# Altium project HLW8012_SCH_PCB.PrjPcb
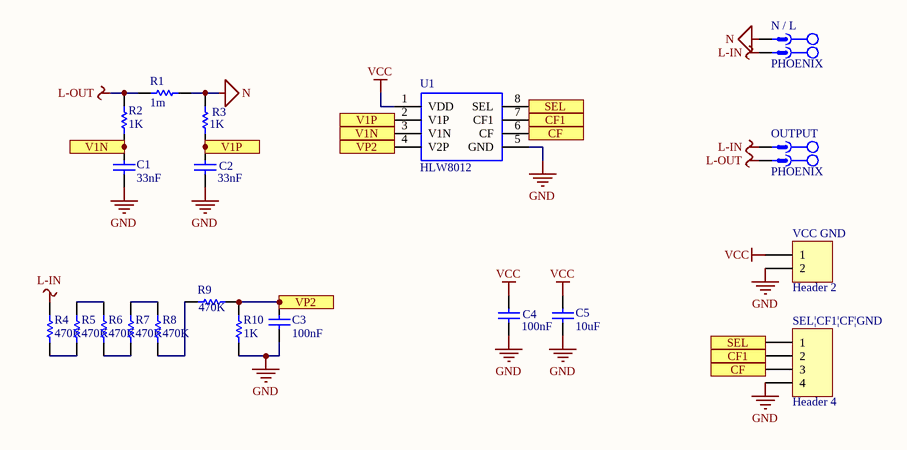
[diagram p0: Sheet.SchDoc]
1 sheet, 20 parts. Net scope: flat (ports and power ports of the same name join across sheets).
Board file: PCB.PcbDoc

## Sheet Sheet.SchDoc
size 203 x 127 mm; SheetNumber: 1; SheetTotal: 1

### Parts
C1  33nF  [CAP0603]
C2  33nF  [CAP0603]
C3  100nF  [CAP0603]
C4  100nF  [CAP805]
C5  10uF  [CAP805]
N_/_L  PHOENIX  [MSTB 2,5/2-G-5,08]
OUTPUT  PHOENIX  [MSTB 2,5/2-G-5,08]
R1  1m  [RES2512]
R2  1K  [RES0603_(1608X06L)]
R3  1K  [RES0603_(1608X06L)]
R4  470K  [RES0603_(1608X06L)]
R5  470K  [RES0603_(1608X06L)]
R6  470K  [RES0603_(1608X06L)]
R7  470K  [RES0603_(1608X06L)]
R8  470K  [RES0603_(1608X06L)]
R9  470K  [RES0603_(1608X06L)]
R10  1K  [RES0603_(1608X06L)]
SEL|CF1|CF|GND  Header 4  [HDR1X4]
U1  HLW8012  [SOIC127P600X170-8N]
VCC_GND  Header 2  [HDR1X2]

### Ports
CF1 (see Sheet[4B]), CF1 (see Sheet[5C]), CF (see Sheet[4B]), CF (see Sheet[5C]), SEL (see Sheet[4B]), SEL (see Sheet[5C]), V1N (see Sheet[1B]), V1N (see Sheet[3B]), V1P (see Sheet[2B]), V1P (see Sheet[3B]), VP2 (see Sheet[3B]), VP2 (see Sheet[3C])

### Nets
GND: C1.1 C2.1 C3.1 C4.1 C5.1 R10.1 SEL|CF1|CF|GND.4 U1.5(GND) VCC_GND.2
L-IN: N_/_L.2 OUTPUT.1 R4.1
L-OUT: OUTPUT.2 R1.2 R2.2
N: N_/_L.1 R1.1 R3.2
VCC: C4.2 C5.2 U1.1(VDD) VCC_GND.1
NetC1_2: C1.2 R2.1 U1.3(V1N) ; port V1N
NetC2_2: C2.2 R3.1 U1.2(V1P) ; port V1P
NetC3_2: C3.2 R9.2 R10.2 U1.4(V2P) ; port VP2
NetR4_2: R4.2 R5.1
NetR5_2: R5.2 R6.1
NetR6_2: R6.2 R7.1
NetR7_2: R7.2 R8.1
NetR8_2: R8.2 R9.1
NetSEL|CF1|CF|GND_1: SEL|CF1|CF|GND.1 U1.8(SEL) ; port SEL
NetSEL|CF1|CF|GND_2: SEL|CF1|CF|GND.2 U1.7(CF1) ; port CF1
NetSEL|CF1|CF|GND_3: SEL|CF1|CF|GND.3 U1.6(CF) ; port CF

### Library data of the parts
C1 C2 C5 = CAP SMD PACKAGE: TOTAL CAPACITOR SMD PACK; Designer: Abbas Basereh; Desc.: CAP SMD TOTAL PACKAGES; VALUE: 100nF; Data: 2017-3-10
C3 C4 = CAP SMD PACKAGE: TOTAL CAPACITOR SMD PACK; Designer: Abbas Basereh; Desc.: CAP SMD TOTAL PACKAGES; Data: 2017-3-10; VALUE: 100nF
N_/_L OUTPUT = CON_Phoenix_MSTB_02: 2 Pitch: 5.08 mm Color: green Contact surface: Tin Assembly; Manufacturer: PHOENIX CONTACT; Connector type: PCB Terminal Block; designer: ABBAS BASEREH; Max Current: 12 A; Positions: 2; Voltage: 320 V; Category: Connector; ComponentLink1Description: Header, Nominal current: 12 A Rated voltage (III/2): 320 V Number of positions: 2 Pitch: 5.08 mm Color: green Contact surface: Tin Assembly: Soldering  DESIGNER:ABBAS BASEREH; ComponentLink2Description: Reference; Mounting Technology: Through-Hole; Pin Count: 2; Revision 1: 2017-3-1; Status: Unreleased; PART.NO: PHOENIX
R1-R10 = RES SMD PACKAGE: TOTAL SMD RESISTOR PACK; Designer: Abbas Basereh; Desc.: RES SMD PAKAGES; Data: 2017-3-10
SEL|CF1|CF|GND = Header 4: Header, 4-Pin; LatestRevisionDate: 17-Jul-2002; LatestRevisionNote: Re-released for DXP Platform.; Publisher: Altium Limited
U1 = HLW8012: single phase energy monitor chip; Manufacturer_Name: Hilwi; Geometry.Height: 1.7mm; Manufacturer_Part_Number: HLW8012; Mouser Part Number: *; Mouser Price/Stock: *; Arrow Part Number: *; Arrow Price/Stock: *; Mouser Testing Part Number: *; Mouser Testing Price/Stock: *; Datasheet Link: https://www.datasheet4u.com/datasheet-parts/HLW8012-datasheet.php?id=1157559
VCC_GND = Header 2: Header, 2-Pin; LatestRevisionDate: 17-Jul-2002; LatestRevisionNote: Re-released for DXP Platform.; Publisher: Altium Limited